# Altium schematic sheet 2  - Power Protection.SchDoc
size A3
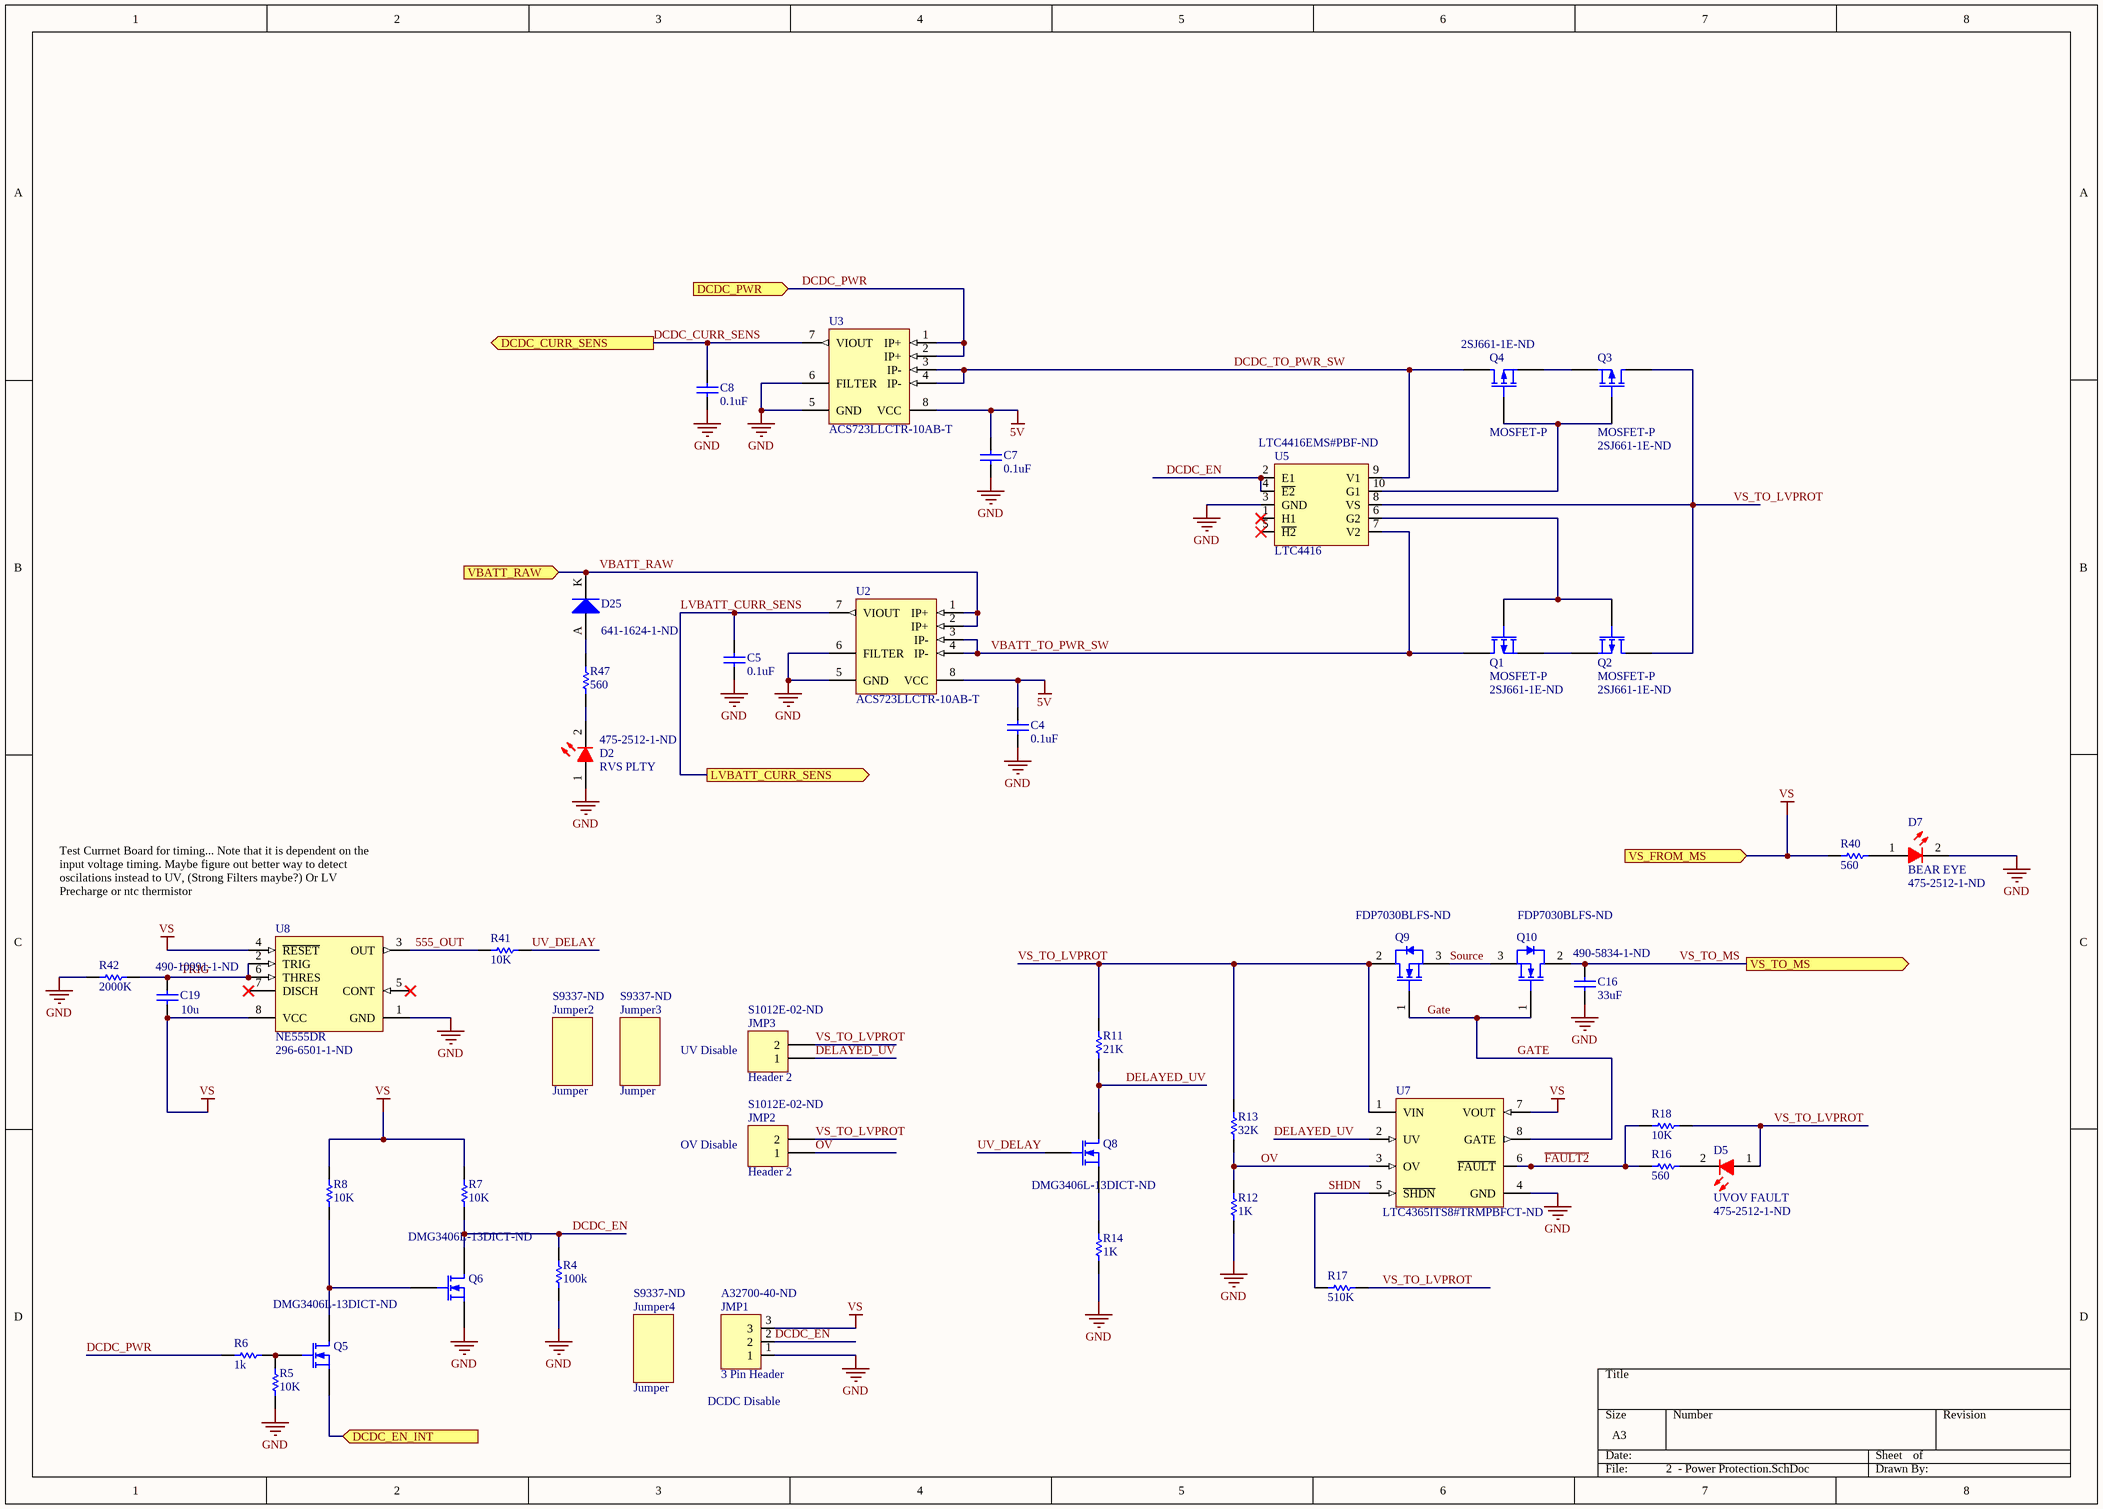
[diagram p0: 2  - Power Protection.SchDoc]

## Parts
C4  value 0.1uF  [1608[0603]]  (hidden comment: Cap Semi)
C5  value 0.1uF  [1608[0603]]  (hidden comment: Cap Semi)
C7  value 0.1uF  [1608[0603]]  (hidden comment: Cap Semi)
C8  value 0.1uF  [1608[0603]]  (hidden comment: Cap Semi)
C16  value 33uF  Supplier Part Number 1: 490-5834-1-ND  [2J-Lead 6.1 x 5.3]  (hidden comment: Cap Semi)
C19  10u  Supplier Part Number 1: 490-10991-1-ND  [C1210]
D2  RVS PLTY  Supplier Part Number 1: 475-2512-1-ND  [TOSH-0603LED_RED_V]
D5  UVOV FAULT  Supplier Part Number 1: 475-2512-1-ND  [TOSH-0603LED_RED_V]
D7  BEAR EYE  Supplier Part Number 1: 475-2512-1-ND  [TOSH-0603LED_RED_V]
D25  Supplier Part Number 1: 641-1624-1-ND  [SOD-123]
JMP1  3 Pin Header  Supplier Part Number 1: A32700-40-ND  [3Pin Jumper]
JMP2  Header 2  Supplier Part Number 1: S1012E-02-ND  [2Pin Jumper]
JMP3  Header 2  Supplier Part Number 1: S1012E-02-ND  [2Pin Jumper]
Jumper2  Jumper  Supplier Part Number 1: S9337-ND
Jumper3  Jumper  Supplier Part Number 1: S9337-ND
Jumper4  Jumper  Supplier Part Number 1: S9337-ND
Q1  MOSFET-P  Supplier Part Number 1: 2SJ661-1E-ND  [P-CH Mosfet]
Q2  MOSFET-P  Supplier Part Number 1: 2SJ661-1E-ND  [P-CH Mosfet]
Q3  MOSFET-P  Supplier Part Number 1: 2SJ661-1E-ND  [P-CH Mosfet]
Q4  MOSFET-P  Supplier Part Number 1: 2SJ661-1E-ND  [P-CH Mosfet]
Q5  Supplier Part Number 1: DMG3406L-13DICT-ND  [SOT-23_N]
Q6  Supplier Part Number 1: DMG3406L-13DICT-ND  [SOT-23_N]
Q8  Supplier Part Number 1: DMG3406L-13DICT-ND  [SOT-23_N]
Q9  Supplier Part Number 1: FDP7030BLFS-ND  [TO220V-GDS]
Q10  Supplier Part Number 1: FDP7030BLFS-ND  [TO220V-GDS]
R4  100k  [1608[0603]]
R5  10K  [1608[0603]]
R6  1k  [1608[0603]]
R7  10K  [1608[0603]]
R8  10K  [1608[0603]]
R11  21K  [RESC0603(1608)_L]
R12  1K  [RESC0603(1608)_L]
R13  32K  [RESC0603(1608)_L]
R14  1K  [RESC0603(1608)_L]
R16  560  [RESC0603(1608)_L]
R17  510K  [RESC0603(1608)_L]
R18  10K  [RESC0603(1608)_L]
R40  560  [RESC0603(1608)_L]
R41  10K  [RESC0603(1608)_L]
R42  2000K  [RESC0603(1608)_L]
R47  560  [RESC0603(1608)_L]
U2  ACS723LLCTR-10AB-T  [ALEG-LC-8_V]
U3  ACS723LLCTR-10AB-T  [ALEG-LC-8_V]
U5  LTC4416  Supplier Part Number 1: LTC4416EMS#PBF-ND  [LTC4416]
U7  Supplier Part Number 1: LTC4365ITS8#TRMPBFCT-ND  [LT-TS8-8-TSOT-23_V]  (hidden comment: LTC4365ITS8#TRMPBF)
U8  NE555DR  Supplier Part Number 1: 296-6501-1-ND  [D0008A_M]

## Ports
DCDC_CURR_SENS (out), DCDC_EN_INT (in), DCDC_PWR (in), LVBATT_CURR_SENS (out), VBATT_RAW (in), VS_FROM_MS (in), VS_TO_MS (out)

## Nets
5V: C4.2 C7.2 U2.8(VCC) U3.8(VCC)
GND: C4.1 C5.1 C7.1 C8.1 C16.2 D2.1(A) D7.2(K) JMP1.1 Q6.2(S) R4.1 R5.1 R12.1 R14.2 R42.2 U2.5(GND) U2.6(FILTER) U3.5(GND) U3.6(FILTER) U5.3(GND) U7.4(GND) U8.1(GND)
VS: C19.2 JMP1.3 R7.2 R8.2 R40.1 U7.7(VOUT) U8.4(~{RESET}) U8.8(VCC) ; port VS_FROM_MS
555_OUT: R41.1 U8.3(OUT)
DCDC_CURR_SENS: C8.2 U3.7(VIOUT) ; port DCDC_CURR_SENS
DCDC_EN: JMP1.2 Q6.3(D) R4.2 R7.1 U5.2(E1) U5.4(~{E2})
DCDC_EN_INT: Q5.2(S) ; port DCDC_EN_INT
DCDC_PWR: R6.1 U3.1(IP+) U3.2(IP+) ; port DCDC_PWR
DCDC_TO_PWR_SW: Q4.2(D) U3.3(IP-) U3.4(IP-) U5.9(V1)
DELAYED_UV: JMP3.1 Q8.3(D) R11.2 U7.2(UV)
~{FAULT2}: R16.1 R18.2 U7.6(~{FAULT})
GATE: Q9.1(G) Q10.1(G) U7.8(GATE)
LVBATT_CURR_SENS: C5.2 U2.7(VIOUT) ; port LVBATT_CURR_SENS
OV: JMP2.1 R12.2 R13.1 U7.3(OV)
SHDN: R17.2 U7.5(~{SHDN})
Source: Q9.3(S) Q10.3(S)
TRIG: C19.1 R42.1 U8.2(TRIG) U8.6(THRES)
UV_DELAY: Q8.1(G) R41.2
VBATT_RAW: D25.K U2.1(IP+) U2.2(IP+) ; port VBATT_RAW
VBATT_TO_PWR_SW: Q1.2(D) U2.3(IP-) U2.4(IP-) U5.7(V2)
VS_TO_LVPROT: D5.1(A) JMP2.2 JMP3.2 Q2.2(D) Q3.2(D) Q9.2(D) R11.1 R13.2 R17.1 R18.1 U5.8(VS) U7.1(VIN)
VS_TO_MS: C16.1 Q10.2(D) ; port VS_TO_MS
NetD2_2: D2.2(K) R47.1
NetD5_2: D5.2(K) R16.2
NetD7_1: D7.1(A) R40.2
NetD25_A: D25.A R47.2
NetQ1_1: Q1.1(G) Q2.1(G) U5.6(G2)
NetQ1_3: Q1.3(S) Q2.3(S)
NetQ3_1: Q3.1(G) Q4.1(G) U5.10(G1)
NetQ3_3: Q3.3(S) Q4.3(S)
NetQ5_1: Q5.1(G) R5.2 R6.2
NetQ5_3: Q5.3(D) Q6.1(G) R8.1
NetQ8_2: Q8.2(S) R14.1

Not connected (* = marked no-connect by the designer): U5 1(H1)* 5(~{H2})*; U8 5(CONT)* 7(DISCH)*

## Notes on the sheet
- Test Currnet Board for timing... Note that it is dependent on the input voltage timing. Maybe figure out better way to detect oscilations instead to UV, (Strong Filters maybe?) Or LV Precharge or ntc thermistor
- UV Disable
- (near JMP2) OV Disable
- (near JMP1) DCDC Disable

## Library data of the parts
C4 C5 C7 C8 C16 = Cap Semi: Capacitor (Semiconductor SIM Model); Published: 8-Jun-2000; LatestRevisionDate: 29-May-2009; LatestRevisionNote: IPC-7351 Footprint Added.; PackageReference: C1206; Publisher: Altium Limited; PackageDescription: Chip Capacitor; Supplier 1: Digi-Key
  C4 C5 C7 C8: Supplier 2: Digi-Key; Supplier Part Number 2: 490-14359-1-ND
C19 = Cap: CAP CER 100UF 6.3V X5R 1206; Manufacturer: Murata Electronics North America; Manufacturer Part Number: GRM31CR60J107ME39K; Capacitance: 100µF; Tolerance: ±20%; RoHS: RoHS Compliant; Category: Capacitors; Packaging: Cut Tape (CT); Part Status: Active; Voltage - Rated: 6.3V; Temperature Coefficient: X5R; Operating Temperature: -55°C ~ 85°C; Features: -; Ratings: -; Applications: General Purpose; Mounting Type: Surface Mount, MLCC; Package / Case: 1206 (3216 Metric); Size / Dimension: 0.126" L x 0.063" W (3.20mm x 1.60mm); Height - Seated (Max): -; Thickness (Max): 0.071" (1.80mm); Lead Spacing: -; Lead Style: -; ComponentLink1URL: http://www.murata.com/~/media/webrenewal/support/library/catalog/products/capacitor/mlcc/c02e.ashx; ComponentLink1Description: http://www.murata.com/~/media/webrenewal/support/library/catalog/products/capacitor/mlcc/c02e.ashx; Supplier 1: Digi-Key
D2 D5 D7 = CMP-0444-00001-1: LED, Red 0603 (1608) 63mCd; Manufacturer: Toshiba; PartNumber: TLSU1008A(T04); Forward Current: 25 mA; Power Dissipation: 60 mW; Packing Type: Reel; Reverse Voltage: 4 V; Mounting Technology: Surface Mount; PackageDescription: 2-Pin SMT LED, 1.6 x 0.8 mm Pitch; ComponentLink1URL: http://www.toshiba-components.com/; ComponentLink1Description: Manufacturer URL; PackageReference: 0603LED_RED; ComponentLink2URL: http://www.semicon.toshiba.co.jp/info/docget.jsp?type=datasheet&lang=en&pid=TLSU1008A(T04); ComponentLink2Description: Datasheet; DatasheetVersion: Aug-08; Storage Temperature: -40 to 100 degC; Supplier 1: Digi-Key
D25 = Diode 1N4003: 1 Amp General Purpose Rectifier; Published: 8-Jun-2000; LatestRevisionDate: 17-Jul-2002; LatestRevisionNote: Re-released for DXP Platform.; DatasheetVersion: 1998; PackageVersion: Aug-1999; PackageReference: DO-41; Publisher: Altium Limited; PackageDescription: Diode, Axial; Body 5.2 x 2.7 mm (LxDia. max), Lead Dia. 0.86 mm (max); Code_JEDEC: DO-204-AL; ComponentLink1Description: Manufacturer Link; ComponentLink1URL: http://www.fairchildsemi.com/; ComponentLink2Description: Datasheet; ComponentLink2URL: http://www.fairchildsemi.com/ds/1N%2F1N4001.pdf; Supplier 1: Digi-Key
JMP2 JMP3 = Header 2: Header, 2-Pin; Manufacturer: Harwin Inc.; Manufacturer Part Number: M20-9990246; Connector Type: Header, Cuttable; Pitch - Mating: 0.100" (2.54mm); Style: Board to Board or Cable; Shrouding: Unshrouded; Number of Positions: 2; Number of Positions Loaded: All; Contact Length - Mating: 0.240" (6.10mm); Contact Length - Post: 0.118" (3.00mm); Overall Contact Length: 0.460" (11.68mm); Material Flammability Rating: UL94 V-0; Current Rating: 3A per Contact; Mated Stacking Heights: 10.04mm, 10.64mm, 11.04mm, 16.54mm; LatestRevisionDate: 17-Jul-2002; LatestRevisionNote: Re-released for DXP Platform.; Publisher: Altium Limited; RoHS: RoHS Compliant; Category: Connectors, Interconnects; Packaging: Bulk; Part Status: Active; Contact Type: Male Pin; Number of Rows: 1; Row Spacing - Mating: -; Mounting Type: Through Hole; Termination: Solder; Fastening Type: Push-Pull; Insulation Height: 0.100" (2.54mm); Contact Shape: Square; Contact Finish - Mating: Tin; Contact Finish Thickness - Mating: -; Contact Finish - Post: Tin; Contact Material: Brass; Insulation Material: Polyamide (PA6T), Nylon 6T; Features: -; Operating Temperature: -40°C ~ 105°C; Ingress Protection: -; Insulation Color: Black; Voltage Rating: -; Contact Finish Thickness - Post: -; Applications: -; ComponentLink1URL: https://cdn.harwin.com/pdfs/M20-999.pdf; ComponentLink1Description: https://cdn.harwin.com/pdfs/M20-999.pdf; Supplier 1: Digi-Key
Q1-Q4 = MOSFET-P: P-Channel MOSFET  2SJ661-DL-1E; Published: 8-Jun-2000; LatestRevisionDate: 17-Jul-2002; LatestRevisionNote: Re-released for DXP Platform.; PackageVersion: 1995/1996; PackageReference: E3; Publisher: Altium Limited; PackageDescription: TO, Flat Index; 3 In-Line, Axial Leads; Body Dia. 4.6mm; Lead Dia. 0.5 mm (max); Supplier 1: Digi-Key
Q5 Q6 Q8 = MOSFET-N: N-Channel MOSFET; Manufacturer: Infineon Technologies; Manufacturer Part Number: IPD075N03L G; FET Type: MOSFET N-Channel, Metal Oxide; FET Feature: Logic Level Gate; Drain to Source Voltage (Vdss): 30V; Current - Continuous Drain (Id) @ 25°C: 50A (Tc); Rds On (Max) @ Id, Vgs: 7.5 mOhm @ 30A, 10V; Vgs(th) (Max) @ Id: 2.2V @ 250µA; Gate Charge (Qg) @ Vgs: 18nC @ 10V; Input Capacitance (Ciss) @ Vds: 1900pF @ 15V; Power - Max: 47W; Published: 8-Jun-2000; LatestRevisionDate: 17-Jul-2002; LatestRevisionNote: Re-released for DXP Platform.; PackageVersion: 1995/1996; PackageReference: E3; Publisher: Altium Limited; PackageDescription: TO, Flat Index; 3 In-Line, Axial Leads; Body Dia. 4.6mm; Lead Dia. 0.5 mm (max); RoHS: RoHS Compliant; Category: Discrete Semiconductor Products; Packaging: Cut Tape (CT); Mounting Type: Surface Mount; Package / Case: TO-252-3, DPak (2 Leads + Tab), SC-63; Supplier Device Package: PG-TO252-3; ComponentLink1URL: http://www.infineon.com/dgdl/Infineon-IPD075N03LG-DS-v02_01-en.pdf?folderId=5546d4694909da4801490a07012f053b&fileId=db3a30431936bc4b011951d824f83aeb; ComponentLink1Description: http://www.infineon.com/dgdl/Infineon-IPD075N03LG-DS-v02_01-en.pdf?folderId=5546d4694909da4801490a07012f053b&fileId=db3a30431936bc4b011951d824f83aeb; ComponentLink2URL: http://www.semicon.toshiba.co.jp/info/docget.jsp?type=datasheet&lang=en&pid=SSM3K329R; ComponentLink2Description: http://www.semicon.toshiba.co.jp/info/docget.jsp?type=datasheet&lang=en&pid=SSM3K329R; Supplier 1: Digi-Key
Q9 Q10 = CMP-1058-00860-1: Power MOSFET, 40 V, 167 A, Single N-Channel, 3-Pin TO-220, Pb-Free, Tube; Qrr Typ (nC): 140; Channel Polarity: N Channel; Crss Typ (pF): 450; Ciss Typ (pF): 4300; Coss Typ (pF): 1075; ID Max (A): 167; PackageDescription: 3-Pin Flange Mount, Vertical Straight Lead, Body 9.97 x 4.445 mm, Pitch 2.54 mm; Configuration: Single; PackageVersion: Rev. AG, 09/2011; RoHS: Pb-Free; PackageReference: TO-220-3-221A-09; Package Type: TO-220-3; DatasheetVersion: Rev. 7; Packing: Tube; Mounting Technology: Through Hole; Supplier 1: Digi-Key
R4 = Res1: Resistor; Manufacturer: Rohm Semiconductor; Manufacturer Part Number: ESR03EZPJ103; Value: 10K; Tolerance: ±5%; Power (Watts): 0.25W, 1/4W; Temperature Coefficient: ±200ppm/°C; Published: 8-Jun-2000; LatestRevisionDate: 17-Jul-2002; LatestRevisionNote: Re-released for DXP Platform.; PackageReference: AXIAL-0.3; Publisher: Altium Limited; PackageDescription: Axial Device, Thru-Hole; 2 Leads; 0.3 in Pin Spacing; Supplier 1: Digi-Key; Supplier Part Number 1: RHM10KDCT-ND; RoHS: RoHS Compliant; Category: Resistors; Stock 1: 8360; Pricing 1: 1=0.15, 10=0.121, 25=0.0836, 100=0.0466, 250=0.03628, 500=0.02884, 1000=0.02046 (CAD); Packaging: Cut Tape (CT); Resistance (Ohms): 10k; Composition: Thick Film; Features: Automotive AEC-Q200, Pulse Withstanding; Operating Temperature: -55°C ~ 155°C; Package / Case: 0603 (1608 Metric); Supplier Device Package: 0603 (1608 Metric); Size / Dimension: 0.063" L x 0.031" W (1.60mm x 0.80mm); Height: 0.022" (0.55mm); Number of Terminations: 2; ComponentLink1URL: http://rohmfs.rohm.com/en/products/databook/datasheet/passive/resistor/chip_resistor/esr.pdf; ComponentLink1Description: http://rohmfs.rohm.com/en/products/databook/datasheet/passive/resistor/chip_resistor/esr.pdf
R5 R7 R8 = Res1: Resistor; Manufacturer: Rohm Semiconductor; Manufacturer Part Number: ESR03EZPJ103; Tolerance: ±5%; Power (Watts): 0.25W, 1/4W; Temperature Coefficient: ±200ppm/°C; Published: 8-Jun-2000; LatestRevisionDate: 17-Jul-2002; LatestRevisionNote: Re-released for DXP Platform.; PackageReference: AXIAL-0.3; Publisher: Altium Limited; PackageDescription: Axial Device, Thru-Hole; 2 Leads; 0.3 in Pin Spacing; Value: 10K; Supplier 1: Digi-Key; Supplier Part Number 1: RHM10KDCT-ND; RoHS: RoHS Compliant; Category: Resistors; Stock 1: 8360; Pricing 1: 1=0.15, 10=0.121, 25=0.0836, 100=0.0466, 250=0.03628, 500=0.02884, 1000=0.02046 (CAD); Packaging: Cut Tape (CT); Resistance (Ohms): 10k; Composition: Thick Film; Features: Automotive AEC-Q200, Pulse Withstanding; Operating Temperature: -55°C ~ 155°C; Package / Case: 0603 (1608 Metric); Supplier Device Package: 0603 (1608 Metric); Size / Dimension: 0.063" L x 0.031" W (1.60mm x 0.80mm); Height: 0.022" (0.55mm); Number of Terminations: 2; ComponentLink1URL: http://rohmfs.rohm.com/en/products/databook/datasheet/passive/resistor/chip_resistor/esr.pdf; ComponentLink1Description: http://rohmfs.rohm.com/en/products/databook/datasheet/passive/resistor/chip_resistor/esr.pdf
R6 = Res1: Resistor; Manufacturer: Panasonic Electronic Components; Manufacturer Part Number: ERJ-3EKF60R4V; Value: 120; Resistance (Ohms): 60.4; Tolerance: ±1%; Power (Watts): 0.1W, 1/10W; Temperature Coefficient: ±100ppm/°C; Published: 8-Jun-2000; LatestRevisionDate: 17-Jul-2002; LatestRevisionNote: Re-released for DXP Platform.; PackageReference: AXIAL-0.3; Publisher: Altium Limited; PackageDescription: Axial Device, Thru-Hole; 2 Leads; 0.3 in Pin Spacing; Supplier 1: Digi-Key; Supplier Part Number 1: P60.4HCT-ND; RoHS: RoHS Compliant; Category: Resistors; Stock 1: 113077; Pricing 1: 1=0.15, 50=0.0176, 100=0.0129, 250=0.00992, 500=0.0079, 1000=0.00583 (CAD); Packaging: Cut Tape (CT); Composition: Thick Film; Features: Automotive AEC-Q200; Operating Temperature: -55°C ~ 155°C; Package / Case: 0603 (1608 Metric); Supplier Device Package: 0603; Size / Dimension: 0.063" L x 0.031" W (1.60mm x 0.80mm); Height: 0.022" (0.55mm); Number of Terminations: 2; ComponentLink1URL: http://industrial.panasonic.com/www-cgi/jvcr13pz.cgi?E+PZ+3+AOA0002+ERJ3EKF60R4V+7+WW; ComponentLink1Description: http://industrial.panasonic.com/www-cgi/jvcr13pz.cgi?E+PZ+3+AOA0002+ERJ3EKF60R4V+7+WW
R11-R14 R16-R18 R40-R42 R47 = CMP-1591-00001-1: 0603 (1608 Metric) Chip Resistor; Case-Metric: 1608; Case-EIA: 0603; PackageReference: RESC0603(1608)
  R12 R13 R42: Supplier 1: Digi-Key
  R16 R47: Supplier 1: Digi-Key; Supplier Part Number 1: P430BZCT-ND
  R18 R41: Supplier 1: Digi-Key; Supplier Part Number 1: 311-10KGRCT-ND
  R40: Supplier 1: Digi-Key; Supplier Part Number 1: P560BZCT-ND
U2 U3 = CMP-0826-00001-1: Linear Current Sensor IC, 4.5 to 5.5 V Supply Voltage, 10 mA Supply Current, -40 to 85 degC, 8-Pin SOIC (LC), RoHS, Tape and Reel; Manufacturer: Allegro Microsystems; PartNumber: ACS712ELCTR-20A-T; CLOAD: 10 nF Max.; ICC: 10 mA; F: 80 kHz; RLOAD: 4.7 kOhm Min.; Optimized Accuracy Range: +/- 20 A; TR: 3.5 us; Sensitivity Sens: 100 mV/A Typ.; Operating Temperature Range: -40 to 85 degC; ComponentLink2URL: http://www.allegromicro.com/~/media/Files/Datasheets/ACS712-Datasheet.ashx; ComponentLink1Description: Manufacturer URL; VCC: 4.5 to 5.5 V; Mounting Technology: Surface Mount; DatasheetVersion: Rev. 15; ComponentLink2Description: Datasheet; ComponentLink1URL: http://www.allegromicro.com/; PackageDescription: 8-Pin SOIC, Body 4.9 x 3.9 mm, Pitch 1.27 mm; PackageReference: LC-8; RoHS: TRUE; Packing: Tape and Reel; Supplier 1: Digi-Key; Supplier Part Number 1: 620-1190-1-ND
U5 = LTC4416: IC Dual Comparator; Supplier 1: Digi-Key
U7 = CMP-0474-00861-1: UV, OV and Reverse Supply Protection Controller, 2.5 to 34 V Vin, 8-pin SOT23 (TS8-8), -40 to 85 degC, Pb-Free, Mini Tape and Reel; Manufacturer: Linear Technology; Fault: yes; Fast Comparator: no; Extended Temp: C, I, H; Circuit Breakers(#): 1; RoHS: TRUE; ComponentLink2URL: http://cds.linear.com/docs/en/datasheet/4365f.pdf; PartNumber: LTC4365ITS8#TRMPBF; ComponentLink3Description: Package Specification; Power Good: no; Packing: Mini Tape and Reel; ComponentLink2Description: Datasheet; Vin Range: 2.5 to 34 V; Active Limiting: no; Foldback: no; Reset: no; ComponentLink3URL: http://cds.linear.com/docs/en/packaging/SOT_8_05-08-1637.pdf; PackageVersion: Rev. A, 08/2010; Code_JEDEC: MO-193; ComponentLink1Description: Manufacturer URL; Mounting Technology: Surface Mount; ComponentLink1URL: http://www.linear.com/; PackageDescription: 8-Pin Plastic TSOT-23, Body 2.9 x 1.63 mm, Pitch 0.65 mm; PackageReference: TS8-8; Supplier 1: Digi-Key
U8 = CMP-1685-00007-1: Precision Timer, 4.5 to 16 V, 0 to 70 degC, 8-Pin SOIC (D8), Green (RoHS & no Sb/Br), Tape and Reel; Forward Voltage: 450 mV; Forward Current: 1 A; Max Surge Current: 30 A; Peak Reverse Current: 500 uA; Case\Package: SMA; PackageReference: D0008A; Width: 2.84 mm; PackageDescription: 8-Pin Small Outline Integrated Circuit, Body 4.9 x 3.9 mm, Pitch 1.27 mm; DatasheetVersion: SLFS022I, 09/2014; ComponentLink2Description: Datasheet; Package Quantity: 1; REACH SVHC: Unknown; Radiation Hardening: No; Height: 2.44 mm; Code_JEDEC: MS-012; Pins: 2; ComponentLink1Description: Manufacturer URL; ComponentLink3Description: Package Specification; ComponentLink3URL: http://www.ti.com/lit/ml/msoi002j/msoi002j.pdf; Length: 4.57 mm; ComponentLink1URL: http://www.ti.com/; Mount: Surface Mount; PackageVersion: 4040047-3/M, 06/2011; ComponentLink2URL: http://www.ti.com/general/docs/lit/getliterature.tsp?genericPartNumber=NE555&fileType=pdf; RoHSCompliant: true; Max Operating Temperature: 125 degC; Packaging: Cut Tape; Min Operating Temperature: -55 degC; Supplier 1: Digi-Key
JMP1 = 3 Pin Header: Supplier 1: Digi-Key
Jumper2-Jumper4 = Jumper: Supplier 1: Digi-Key